# Altium schematic sheet 280W-SE-HD_V1.0 SMT2410.SchDoc
size 599 x 449 mm; SheetNumber: 2; SheetTotal: 2
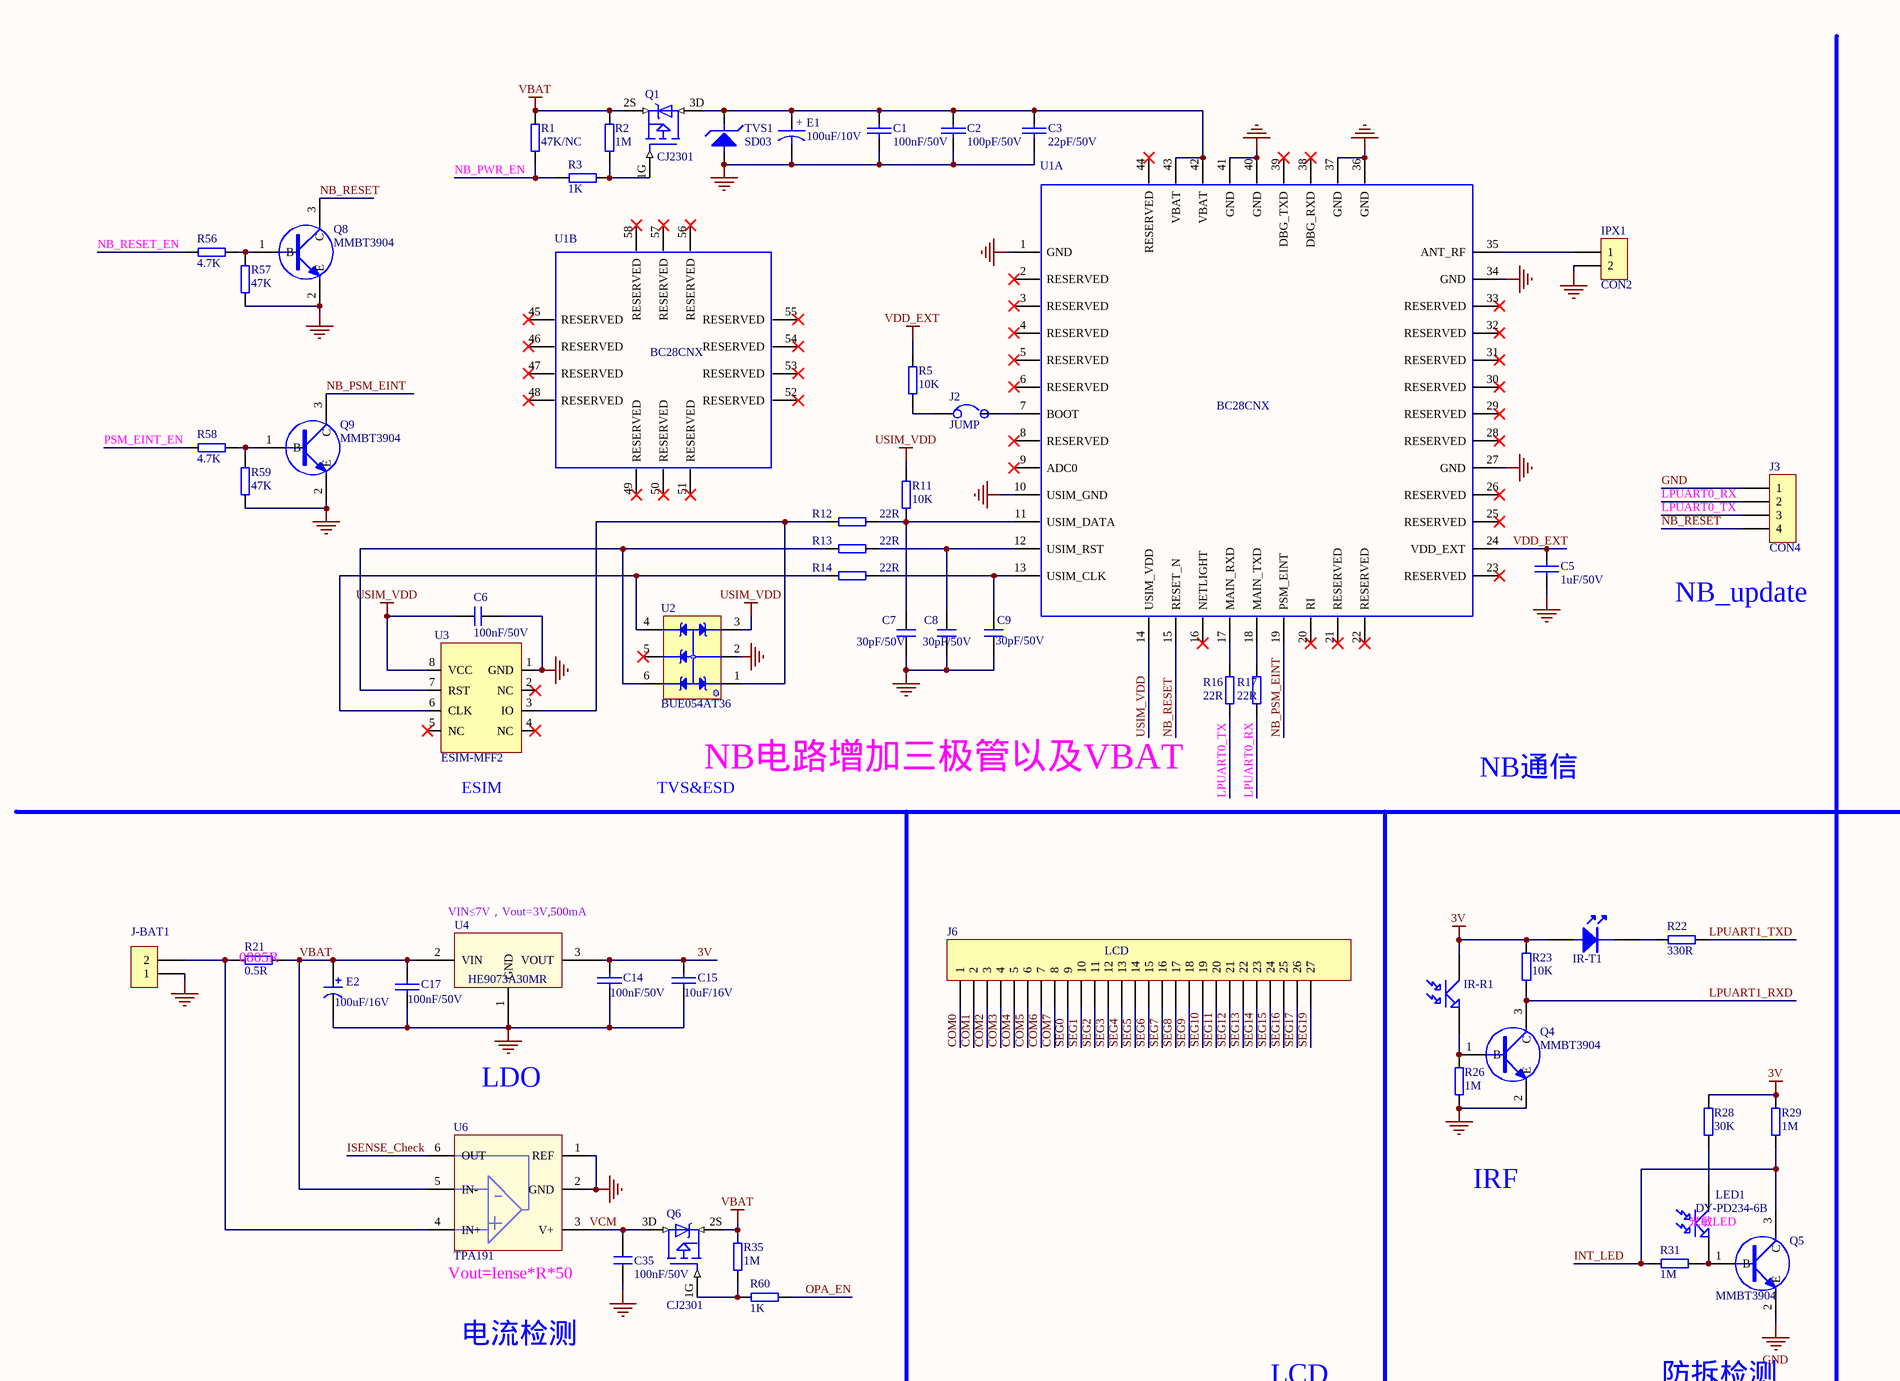
[diagram p0: 280W-SE-HD_V1.0 SMT2410.SchDoc, top left]
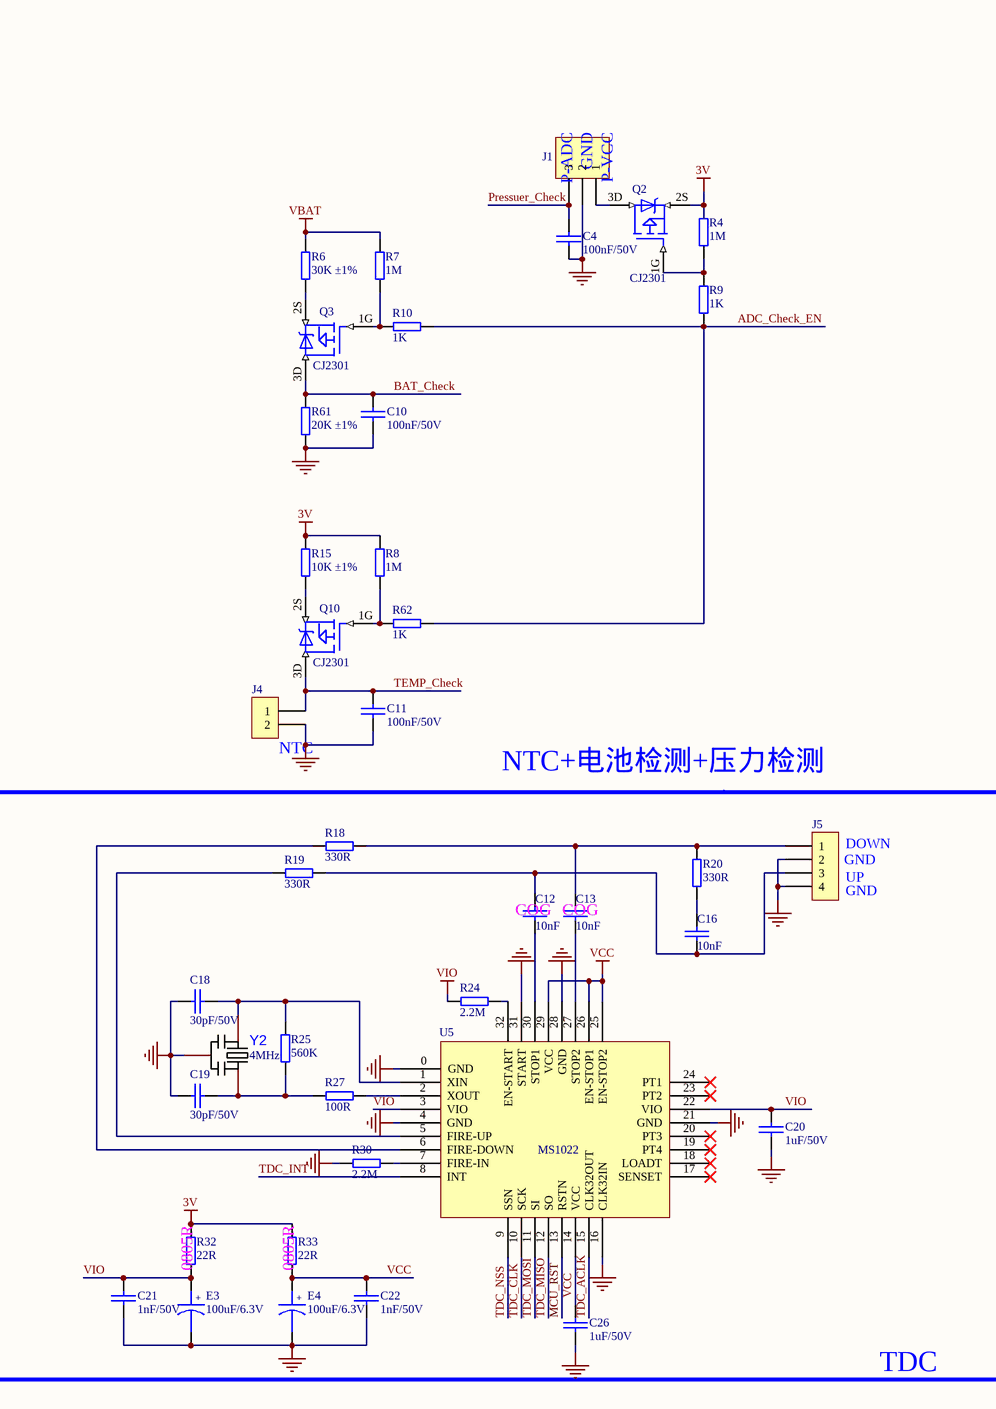
[diagram p1: 280W-SE-HD_V1.0 SMT2410.SchDoc, top right]
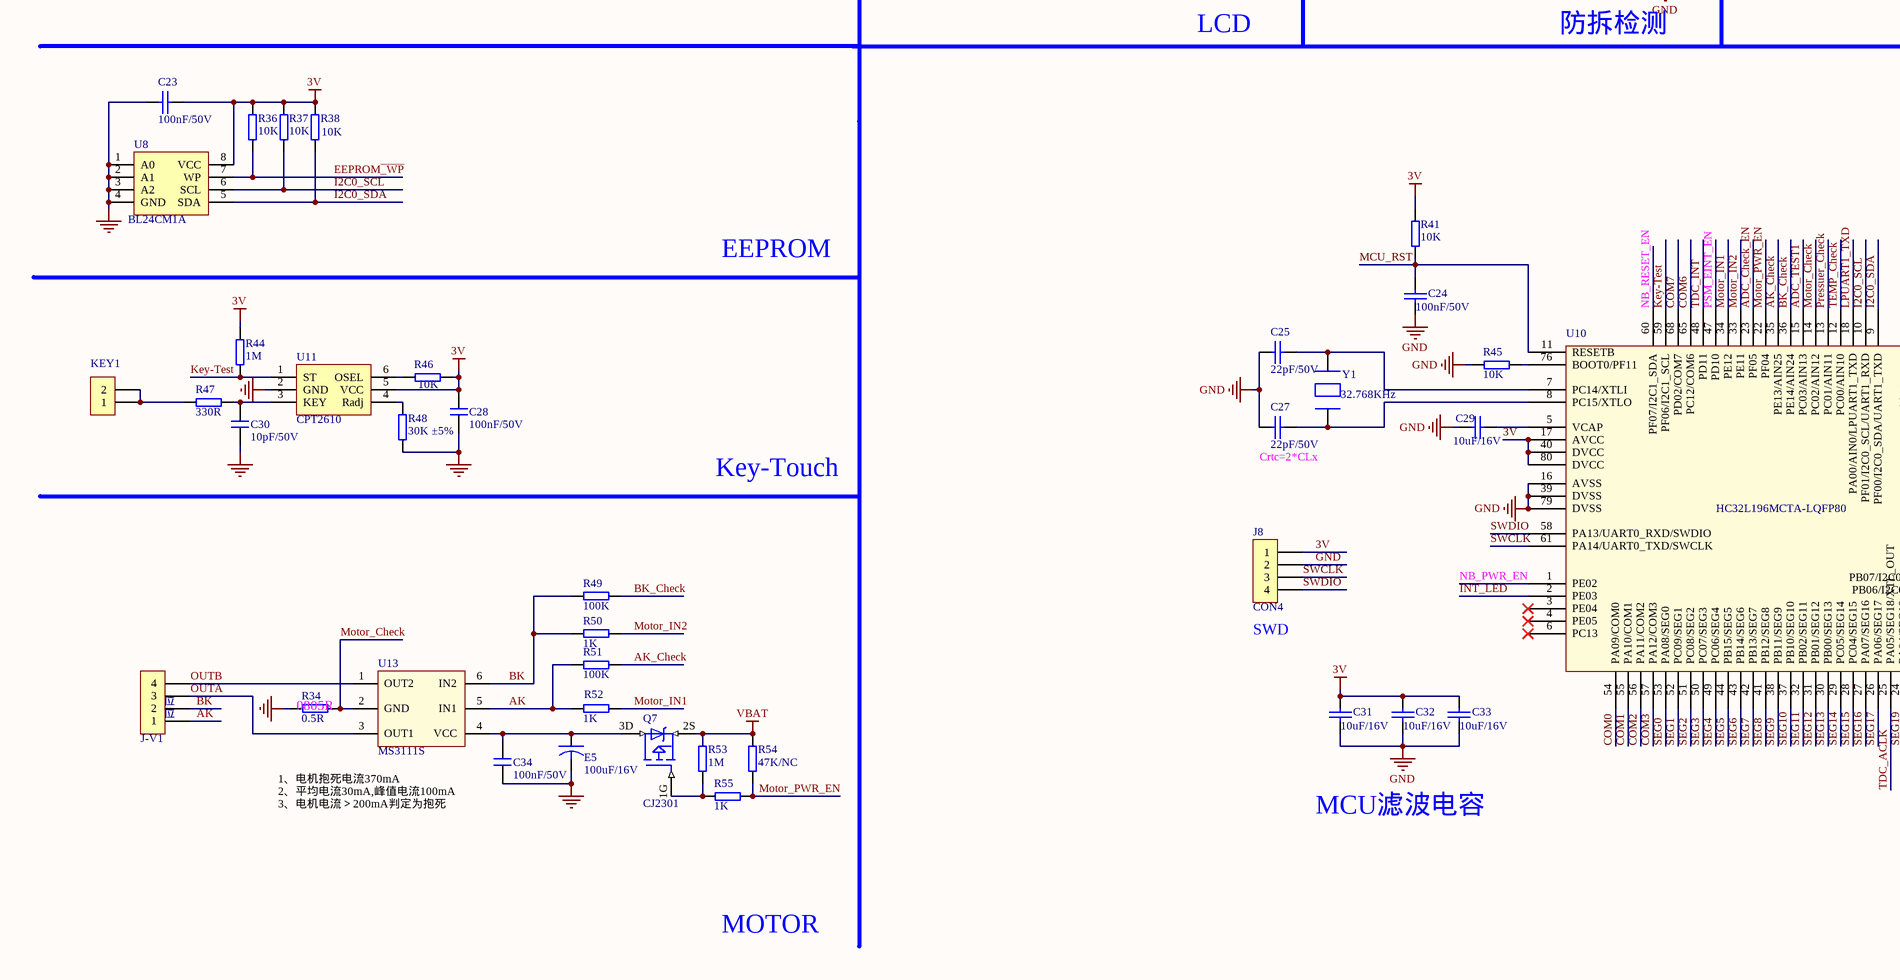
[diagram p2: 280W-SE-HD_V1.0 SMT2410.SchDoc, bottom left]
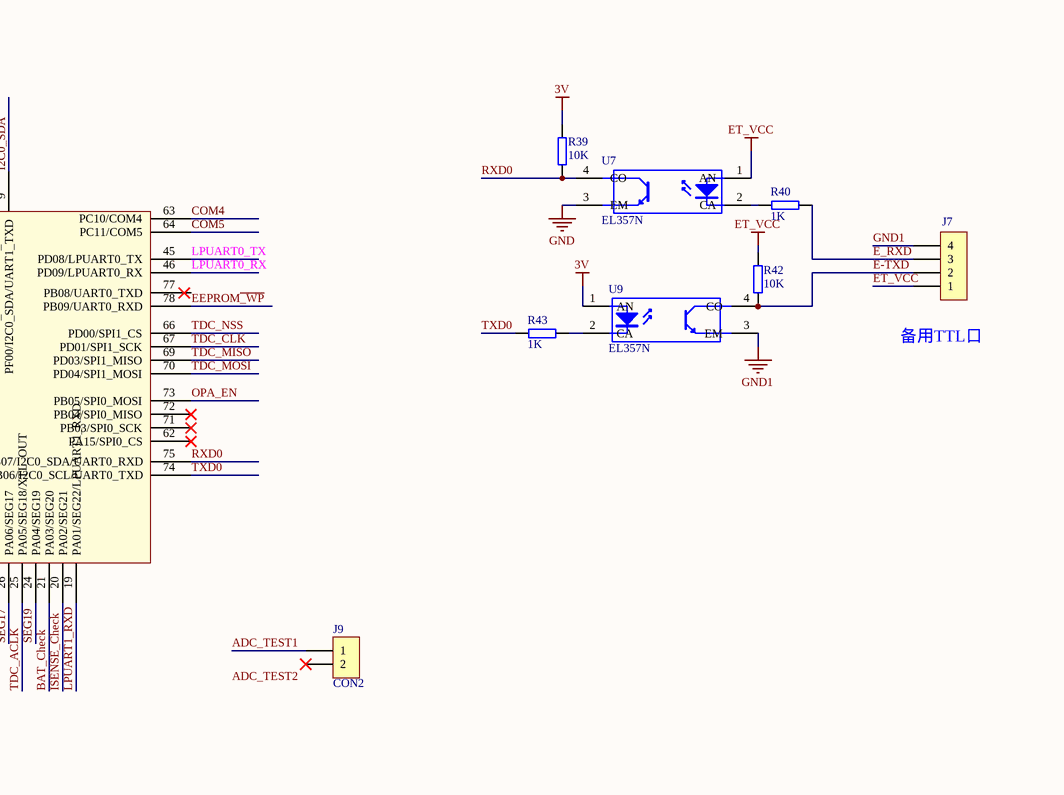
[diagram p3: 280W-SE-HD_V1.0 SMT2410.SchDoc, bottom right]

## Parts
C1  100nF/50V  [C0603]
C2  100pF/50V  [C0603]
C3  22pF/50V  [C0603]
C4  100nF/50V  [C0603]
C5  1uF/50V  [C0603]
C6  100nF/50V  [C0603]
C7  30pF/50V  [C0603]
C8  30pF/50V  [C0603]
C9  30pF/50V  [C0603]
C10  100nF/50V  [C0603]
C11  100nF/50V  [C0603]
C12  10nF  [C0603]
C13  10nF  [C0603]
C14  100nF/50V  [C0603]
C15  10uF/16V  [C0603]
C16  10nF  [C0603]
C17  100nF/50V  [C0603]
C18  30pF/50V  [C0603]
C19  30pF/50V  [C0603]
C20  1uF/50V  [C0603]
C21  1nF/50V  [C0603]
C22  1nF/50V  [C0603]
C23  100nF/50V  [C0603]
C24  100nF/50V  [C0603]
C25  22pF/50V  [C0603]
C26  1uF/50V  [C0603]
C27  22pF/50V  [C0603]
C28  100nF/50V  [C0603]
C29  10uF/16V  [C0603]
C30  10pF/50V  [C0603]
C31  10uF/16V  [C0603]
C32  10uF/16V  [C0603]
C33  10uF/16V  [C0603]
C34  100nF/50V  [C0603]
C35  100nF/50V  [C0603]
E1  100uF/10V  [CASE-A_3216]
E2  100uF/16V  [SMD,6.3x5.4mm]
E3  100uF/6.3V  [SMD,6.3x5.4mm]
E4  100uF/6.3V  [SMD,6.3x5.4mm]
E5  100uF/16V  [SMD,6.3x5.4mm]
IPX1  CON2  [IPX]
IR-R1  3mm黑色红外灯  [LED-5]  (value not drawn)
IR-T1  3mm透明红外灯  [LED-5]  (value not drawn)
J1  CON3  [SIP-2.54-3]  (value not drawn)
J2  JUMP  [SIP-2.54-2]
J3  CON4  [SIP-2.54-4]
J4  (no value)  [SIP-2.54-2]
J5  CON4  [SIP-2.54-4]  (value not drawn)
J6  LCD  [LHR95930PA]
J7  TTL  [SIP-2.54-4]  (value not drawn)
J8  CON4  [XH-4P-2.54]
J9  CON2  [SIP-2.00-2]
J-BAT1  (no value)  [SIP-2.54-2]
J-V1  NC  [SIP-2.54-4]  (value not drawn)
KEY1  (no value)  [Key-Touch]
LED1  DY-PD234-6B  [LED-Φ3]
Q1  CJ2301  [SOT23_MOS]
Q2  CJ2301  [SOT23_MOS]
Q3  CJ2301  [SOT23_MOS]
Q4  MMBT3904  [SOT-23]
Q5  MMBT3904  [SOT-23]
Q6  CJ2301  [SOT23_MOS]
Q7  CJ2301  [SOT23_MOS]
Q8  MMBT3904  [SOT-23]
Q9  MMBT3904  [SOT-23]
Q10  CJ2301  [SOT23_MOS]
R1  47K/NC  [R0603]
R2  1M  [R0603]
R3  1K  [R0603]
R4  1M  [R0603]
R5  10K  [R0603]
R6  30K ±1%  [R0603]
R7  1M  [R0603]
R8  1M  [R0603]
R9  1K  [R0603]
R10  1K  [R0603]
R11  10K  [R0603]
R12  22R  [R0603]
R13  22R  [R0603]
R14  22R  [R0603]
R15  10K ±1%  [R0603]
R16  22R  [R0603]
R17  22R  [R0603]
R18  330R  [R0603]
R19  330R  [R0603]
R20  330R  [R0603]
R21  0.5R  [R0805]
R22  330R  [R0603]
R23  10K  [R0603]
R24  2.2M  [R0603]
R25  560K  [R0603]
R26  1M  [R0603]
R27  100R  [R0603]
R28  30K  [R0603]
R29  1M  [R0603]
R30  2.2M  [R0603]
R31  1M  [R0603]
R32  22R  [R0805]
R33  22R  [R0805]
R34  0.5R  [R0805]
R35  1M  [R0603]
R36  10K  [R0603]
R37  10K  [R0603]
R38  10K  [R0603]
R39  10K  [R0603]
R40  1K  [R0603]
R41  10K  [R0603]
R42  10K  [R0603]
R43  1K  [R0603]
R44  1M  [R0603]
R45  10K  [R0603]
R46  10K  [R0603]
R47  330R  [R0603]
R48  30K ±5%  [R0603]
R49  100K  [R0603]
R50  1K  [R0603]
R51  100K  [R0603]
R52  1K  [R0603]
R53  1M  [R0603]
R54  47K/NC  [R0603]
R55  1K  [R0603]
R56  4.7K  [R0603]
R57  47K  [R0603]
R58  4.7K  [R0603]
R59  47K  [R0603]
R60  1K  [R0603]
R61  20K ±1%  [R0603]
R62  1K  [R0603]
TVS1  SD03  [SOD-323]
U1  BC28CNX  [LCC44]  (parts A,B of 2)
U2  BUE054AT36  [SOT-353-6]
U3  ESIM-MFF2  [ESIM8_VQFN8_MFF2]
U4  HE9073A30MR  [SOT-23-3]
U5  MS1022  [QFN32-5X5X05P]
U6  TPA191  [SOT-363]
U7  EL357N  [SOP-4_P2.54]
U8  BL24CM1A  [SOP-8_150mil]
U9  EL357N  [SOP-4_P2.54]
U10  HC32L196MCTA-LQFP80  [LQFP-80_12x12x05P]
U11  CPT2610  [SOT-23-6]
U13  MS3111S  [SOT-23-6]
Y1  32.768KHz  [SMD3215-2P]
Y2  4MHz  [SIP-3-2.5mm]

## Nets
3V: C14.1 C15.1 C23.2 C28.1 C31.1 C32.1 C33.1 IR-R1.1(C) IR-T1.1(A) J8.1 Q2.2S R4.2 R8.2 R15.2 R23.2 R28.2 R29.2 R32.2 R33.2 R36.1 R37.1 R38.1 R39.1 R41.2 R44.1 R46.1 U4.3(VOUT) U8.8(VCC) U9.1(AN) U10.17(AVCC) U10.40(DVCC) U10.80(DVCC) U11.5(VCC)
ET_VCC: J7.1 R42.1 U7.1(AN)
GND: C1.1 C2.1 C3.1 C4.2 C5.1 C6.1 C7.1 C8.1 C9.1 C10.2 C11.2 C14.2 C15.2 C17.2 C18.2 C19.2 C20.2 C21.1 C22.1 C23.1 C24.2 C25.1 C26.2 C27.2 C28.2 C29.1 C30.2 C31.2 C32.2 C33.2 C34.2 C35.2 E1.2 E2.2 E3.2 E4.2 E5.2 IPX1.2 J1.2 J3.1 J4.2 J5.2 J5.4 J8.2 J-BAT1.1 Q4.2(E) Q5.2(E) Q8.2(E) Q9.2(E) R26.1 R30.2 R34.1 R45.1 R48.2 R57.2 R59.2 R61.1 TVS1.2 U1.1(GND) U1.10(USIM_GND) U1.27(GND) U1.34(GND) U1.36(GND) U1.37(GND) U1.40(GND) U1.41(GND) U2.2(GND) U3.1(GND) U4.1(GND) U5.0(GND) U5.4(GND) U5.16(CLK32IN) U5.21(GND) U5.28(GND) U5.31(START) U6.1(REF) U6.2(GND) U7.3(EM) U8.1(A0) U8.2(A1) U8.3(A2) U8.4(GND) U10.16(AVSS) U10.39(DVSS) U10.79(DVSS) U11.2(GND) Y2.2(GND)
GND1: J7.4 U9.3(EM)
USIM_VDD: C6.2 R11.1 U1.14(USIM_VDD) U2.3(IO2) U3.8(VCC)
VBAT: C17.1 E2.1 Q1.2S Q6.2S Q7.2S R1.2 R2.1 R6.2 R7.2 R21.2 R35.2 R53.2 R54.2 U4.2(VIN) U6.5(IN-)
VCC: C22.2 C26.1 E4.1 R33.1 U5.14(VCC) U5.25(EN-STOP2) U5.26(EN-STOP1) U5.29(VCC)
VDD_EXT: C5.2 R5.1 U1.24(VDD_EXT)
VIO: C20.1 C21.2 E3.1 R24.1 R32.1 U5.3(VIO) U5.22(VIO)
ADC_Check_EN: R9.2 R10.1 R62.1 U10.23(PF05)
ADC_TEST1: J9.1 U10.15(PC03/AIN13)
AK: J-V1.1 R51.1 R52.1 U13.5(IN1)
AK_Check: R51.2 U10.35(PE13/AIN25)
BAT_Check: C10.1 Q3.3D R61.2 U10.21(PA03/SEG20)
BK: J-V1.2 R49.1 R50.1 U13.6(IN2)
BK_Check: R49.2 U10.36(PE14/AIN24)
COM0: J6.1 U10.54(PA09/COM0)
COM1: J6.2 U10.55(PA10/COM1)
COM2: J6.3 U10.56(PA11/COM2)
COM3: J6.4 U10.57(PA12/COM3)
COM4: J6.5 U10.63(PC10/COM4)
COM5: J6.6 U10.64(PC11/COM5)
COM6: J6.7 U10.65(PC12/COM6)
COM7: J6.8 U10.68(PD02/COM7)
E-TXD: J7.2 R42.2 U9.4(CO)
E_RXD: J7.3 R40.2
EEPROM~{_WP}: R36.2 U8.7(WP) U10.78(PB09/UART0_RXD)
I2C0_SCL: R37.2 U8.6(SCL) U10.10(PF01/I2C0_SCL/UART1_RXD)
I2C0_SDA: R38.2 U8.5(SDA) U10.9(PF00/I2C0_SDA/UART1_TXD)
INT_LED: Q5.3(C) R29.1 R31.2 U10.2(PE03)
ISENSE_Check: U6.6(OUT) U10.20(PA02/SEG21)
Key-Test: R44.2 U10.59(PF06/I2C1_SCL) U11.1(ST)
LPUART0_RX: J3.2 R17.1 U10.46(PD09/LPUART0_RX)
LPUART0_TX: J3.3 R16.1 U10.45(PD08/LPUART0_TX)
LPUART1_RXD: Q4.3(C) R23.1 U10.19(PA01/SEG22/LPUART1_RXD)
LPUART1_TXD: R22.1 U10.18(PA00/AIN0/LPUART1_TXD)
MCU_RST: C24.1 R41.1 U5.13(RSTN) U10.11(RESETB)
Motor_Check: R34.2 U10.14(PC02/AIN12) U13.2(GND)
Motor_IN1: R52.2 U10.34(PE12)
Motor_IN2: R50.2 U10.33(PE11)
Motor_PWR_EN: R54.1 R55.2 U10.22(PF04)
NB_PSM_EINT: Q9.3(C) U1.19(PSM_EINT)
NB_PWR_EN: R1.1 R3.2 U10.1(PE02)
NB_RESET: J3.4 Q8.3(C) U1.15(RESET_N)
NB_RESET_EN: R56.1 U10.60(PF07/I2C1_SDA)
OPA_EN: R60.1 U10.73(PB05/SPI0_MOSI)
OUTA: J-V1.3 U13.3(OUT1)
OUTB: J-V1.4 U13.1(OUT2)
Pressuer_Check: C4.1 J1.3 U10.13(PC01/AIN11)
PSM_EINT_EN: R58.1 U10.47(PD10)
RXD0: R39.2 U7.4(CO) U10.75(PB07/I2C0_SDA/UART0_RXD)
SEG0: J6.9 U10.53(PA08/SEG0)
SEG1: J6.10 U10.52(PC09/SEG1)
SEG2: J6.11 U10.51(PC08/SEG2)
SEG3: J6.12 U10.50(PC07/SEG3)
SEG4: J6.13 U10.49(PC06/SEG4)
SEG5: J6.14 U10.44(PB15/SEG5)
SEG6: J6.15 U10.43(PB14/SEG6)
SEG7: J6.16 U10.42(PB13/SEG7)
SEG8: J6.17 U10.41(PB12/SEG8)
SEG9: J6.18 U10.38(PB11/SEG9)
SEG10: J6.19 U10.37(PB10/SEG10)
SEG11: J6.20 U10.32(PB02/SEG11)
SEG12: J6.21 U10.31(PB01/SEG12)
SEG13: J6.22 U10.30(PB00/SEG13)
SEG14: J6.23 U10.29(PC05/SEG14)
SEG15: J6.24 U10.28(PC04/SEG15)
SEG16: J6.25 U10.27(PA07/SEG16)
SEG17: J6.26 U10.26(PA06/SEG17)
SEG19: J6.27 U10.24(PA04/SEG19)
SWCLK: J8.3 U10.61(PA14/UART0_TXD/SWCLK)
SWDIO: J8.4 U10.58(PA13/UART0_RXD/SWDIO)
TDC_ACLK: U5.15(CLK32OUT) U10.25(PA05/SEG18/XTL_OUT)
TDC_CLK: U5.10(SCK) U10.67(PD01/SPI1_SCK)
TDC_INT: U5.8(INT) U10.48(PD11)
TDC_MISO: U5.12(SO) U10.69(PD03/SPI1_MISO)
TDC_MOSI: U5.11(SI) U10.70(PD04/SPI1_MOSI)
TDC_NSS: U5.9(SSN) U10.66(PD00/SPI1_CS)
TEMP_Check: C11.1 J4.1 Q10.3D U10.12(PC00/AIN10)
TXD0: R43.1 U10.74(PB06/I2C0_SCL/UART0_TXD)
VCM: C35.1 Q6.3D U6.3(V+)
NetC1_2: C1.2 C2.2 C3.2 E1.1 Q1.3D TVS1.1 U1.42(VBAT) U1.43(VBAT)
NetC7_2: C7.2 R11.2 R12.2 U1.11(USIM_DATA)
NetC8_2: C8.2 R13.2 U1.12(USIM_RST)
NetC9_2: C9.2 R14.2 U1.13(USIM_CLK)
NetC12_1: C12.1 C16.2 J5.3 R19.1
NetC12_2: C12.2 U5.30(STOP1)
NetC13_1: C13.1 J5.1 R18.1 R20.1
NetC13_2: C13.2 U5.27(STOP2)
NetC16_1: C16.1 R20.2
NetC18_1: C18.1 R25.2 U5.1(XIN) Y2.1(IN)
NetC19_1: C19.1 R25.1 R27.2 Y2.3(OUT)
NetC25_2: C25.2 U10.7(PC14/XTLI) Y1.2
NetC27_1: C27.1 U10.8(PC15/XTLO) Y1.1
NetC29_2: C29.2 U10.5(VCAP)
NetC30_1: C30.1 R47.1 U11.3(KEY)
NetC34_1: C34.1 E5.1 Q7.3D U13.4(VCC)
NetIPX1_1: IPX1.1 U1.35(ANT_RF)
NetIR-R1_2: IR-R1.2(E) Q4.1(B) R26.2
NetIR-T1_2: IR-T1.2(B) R22.2
NetJ1_1: J1.1 Q2.3D
NetJ2_1: J2.1 R5.2
NetJ2_2: J2.2 U1.7(BOOT)
NetJ-BAT1_2: J-BAT1.2 R21.1 U6.4(IN+)
NetKEY1_1: KEY1.1 KEY1.2 R47.2
NetLED1_A: LED1.A R28.1
NetLED1_K: LED1.K Q5.1(B) R31.1
NetQ1_1G: Q1.1G R2.2 R3.1
NetQ2_1G: Q2.1G R4.1 R9.1
NetQ3_1G: Q3.1G R7.1 R10.2
NetQ3_2S: Q3.2S R6.1
NetQ6_1G: Q6.1G R35.1 R60.2
NetQ7_1G: Q7.1G R53.1 R55.1
NetQ8_1: Q8.1(B) R56.2 R57.1
NetQ9_1: Q9.1(B) R58.2 R59.1
NetQ10_1G: Q10.1G R8.1 R62.2
NetQ10_2S: Q10.2S R15.1
NetR12_1: R12.1 U2.1(IO1) U3.3(IO)
NetR13_1: R13.1 U2.6(IO5) U3.7(RST)
NetR14_1: R14.1 U2.4(IO3) U3.6(CLK)
NetR16_2: R16.2 U1.17(MAIN_RXD)
NetR17_2: R17.2 U1.18(MAIN_TXD)
NetR18_2: R18.2 U5.6(FIRE-DOWN)
NetR19_2: R19.2 U5.5(FIRE-UP)
NetR24_2: R24.2 U5.32(EN-START)
NetR27_1: R27.1 U5.2(XOUT)
NetR30_1: R30.1 U5.7(FIRE-IN)
NetR40_1: R40.1 U7.2(CA)
NetR43_2: R43.2 U9.2(CA)
NetR45_2: R45.2 U10.76(BOOT0/PF11)
NetR46_2: R46.2 U11.6(OSEL)
NetR48_1: R48.1 U11.4(Radj)

Not connected (* = marked no-connect by the designer): J9 2*; U1 2(RESERVED)* 3(RESERVED)* 4(RESERVED)* 5(RESERVED)* 6(RESERVED)* 8(RESERVED)* 9(ADC0)* 16(NETLIGHT)* 20(RI)* 21(RESERVED)* 22(RESERVED)* 23(RESERVED)* 25(RESERVED)* 26(RESERVED)* 28(RESERVED)* 29(RESERVED)* 30(RESERVED)* 31(RESERVED)* 32(RESERVED)* 33(RESERVED)* 38(DBG_RXD)* 39(DBG_TXD)* 44(RESERVED)* 45(RESERVED)* 46(RESERVED)* 47(RESERVED)* 48(RESERVED)* 49(RESERVED)* 50(RESERVED)* 51(RESERVED)* 52(RESERVED)* 53(RESERVED)* 54(RESERVED)* 55(RESERVED)* 56(RESERVED)* 57(RESERVED)* 58(RESERVED)*; U2 5(IO4)*; U3 2(NC)* 4(NC)* 5(NC)*; U5 17(SENSET)* 18(LOADT)* 19(PT4)* 20(PT3)* 23(PT2)* 24(PT1)*; U10 3(PE04)* 4(PE05)* 6(PC13)* 62(PA15/SPI0_CS)* 71(PB03/SPI0_SCK)* 72(PB04/SPI0_MISO)* 77(PB08/UART0_TXD)

## Notes on the sheet
- (near J1) P-ADC
- (near J1) GND
- (near J1) P-VCC
- (near J3) NB_update
- (near U3) ESIM
- TVS&ESD
- NB电路增加三极管以及VBAT
- NB通信
- (near J4) NTC
- NTC+电池检测+压力检测
- (near J5) DOWN
- (near U4) VIN≤7V，Vout=3V,500mA
- (near C12) COG
- (near C13) COG
- (near J5) GND
- (near J5) UP
- (near R21) 0805R
- LDO
- IRF
- (near LED1) 光敏LED
- Vout=Iense*R*50
- 电流检测
- (near R32) 0805R
- (near R33) 0805R
- LCD
- 防拆检测
- TDC
- EEPROM
- Key-Touch
- (near C27) Crtc=2*CLx
- (near J7) 备用TTL口
- (near J8) SWD
- (near J-V1) 关限位
- (near J-V1) 开限位
- (near R34) 0805R
- 1、电机抱死电流370mA
  2、平均电流30mA,峰值电流100mA
  3、电机电流＞200mA判定为抱死
- MCU滤波电容
- MOTOR
- Labels drawn without touching a wire or pin: ADC_TEST2
- (in symbol CAPACITOR POL) +
- (in symbol ECAP) +

## Library data of the parts
C1 C5 = CAP: Capacitor; 封装: 0603; Value: 100nF; 封装: 0805; 名称: CAP; 物料编码: *; 原厂品牌: *; 原厂型号: *
C2 = CAP: Capacitor; 封装: 0603; Value: 100pF; 封装: 0805; 名称: CAP; 物料编码: *; 原厂品牌: *; 原厂型号: *
C3 = CAP: Capacitor; 封装: 0603; Value: 22pF; 封装: 0805; 名称: CAP; 物料编码: *; 原厂品牌: *; 原厂型号: *
C4 C10-C13 C16 C18-C22 C26 = CAP: Capacitor
C6-C9 C28 C30 C34 C35 = 0603C
C14 C15 C17 C24 C25 C27 C29 C31-C33 = CAP: 0.1uF
C23 = CAP
E1 = ECAP
E2 = CAP-1
E3 E4 = CAPACITOR POL: Capacitor
E5 = CAPACITOR
IPX1 J4 J9 J-BAT1 KEY1 = CON2: Connector
IR-R1 = PHOTO NPN: NPN Phototransistor
IR-T1 = LED
J1 = 3P
J3 J5 J7 J8 J-V1 = CON4: Connector
J6 = CON29: Connector
LED1 = PHOTO NPN: DY-PD234-6B,TONYU(东裕)
Q1-Q3 Q6 Q7 Q10 = P-MOSFET-P
Q4 = NPN
Q5 Q8 Q9 = 3904
R1 R4 R6-R10 R15 R18-R20 R22-R33 R35-R38 R41 R45 R53-R55 R60-R62 = RES2X
R2 R3 R5 R11-R14 R16 R17 R21 R34 R39 R40 R42-R44 R46-R52 R56-R59 = 0603R
TVS1 = TVS-F: SD03,鲁光
U1 = BC660K-GL: Manufacturer: Quectel; Part Description: NB-IoT Module BC660K-GL 17.7x15.8mm H2.2mm RO; Geometry.Height: 2.2mm; Value: BC660K-GL
U2 = ESDA6V1-5W6
U3 = USIM-MFF2
U5 = GP22
U6 = TP181A1-CR
U7 U9 = OPTOISO1: Optoisolator
U8 = AT24C512C
U10 = HC32L176MATA-LQFP80
Y1 = Crystal2
Y2 = CSTCR4M00G53-R0: Manufacturer: muRata(村田); Add into BOM: yes; Frequency Stability: ±0.2%; Frequency Tolerance: ±0.5%; Built-in Load Capacitance: 15pF; Resonant Impedance: 60Ω; Name: 4MHz; Symbol: CSTCR4M00G53-R0; Device: CSTCR4M00G53-R0; LCSC Part Name: 4MHz ±0.5% 内置负载电容:15pF; Supplier Part: C22122; Manufacturer Part: CSTCR4M00G53-R0; Supplier Footprint: SMD4520-3P; JLCPCB Part Class: Extended Part; Datasheet: https://atta.szlcsc.com/upload/public/pdf/source/20161226/1482720137275.pdf; Supplier: LCSC; Convert to PCB: yes; Value: 4MHz; Operating Temperature: -20℃~+80℃